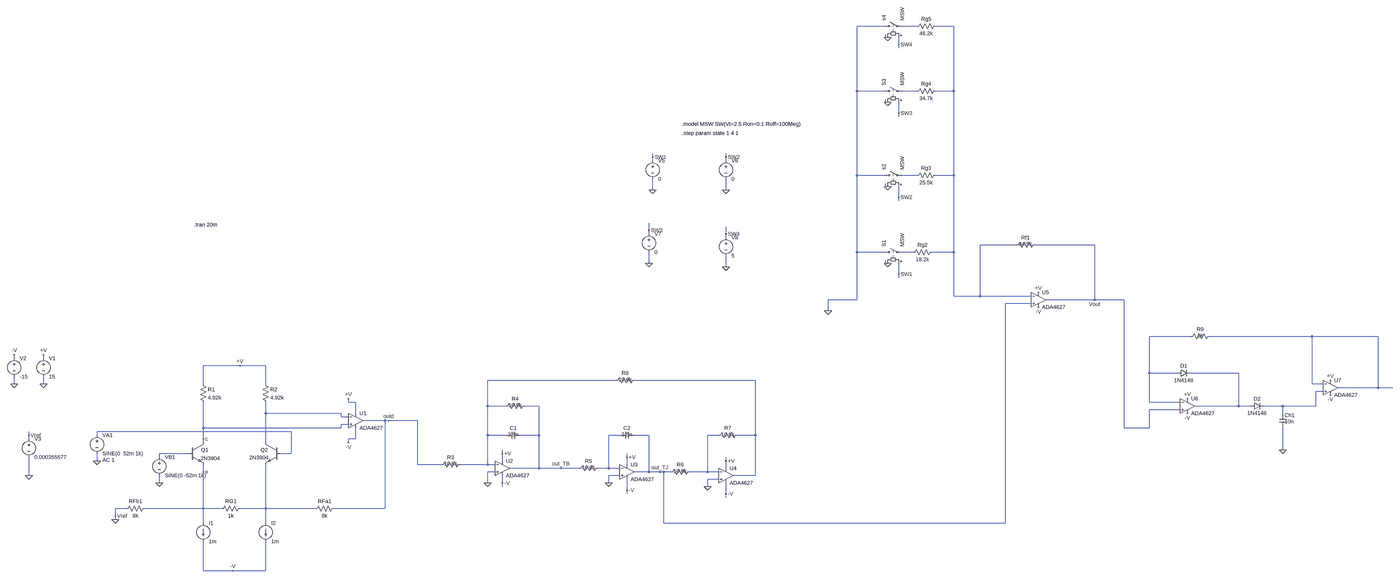
[diagram p0: schematic circuitcomplet.asc, whole sheet]
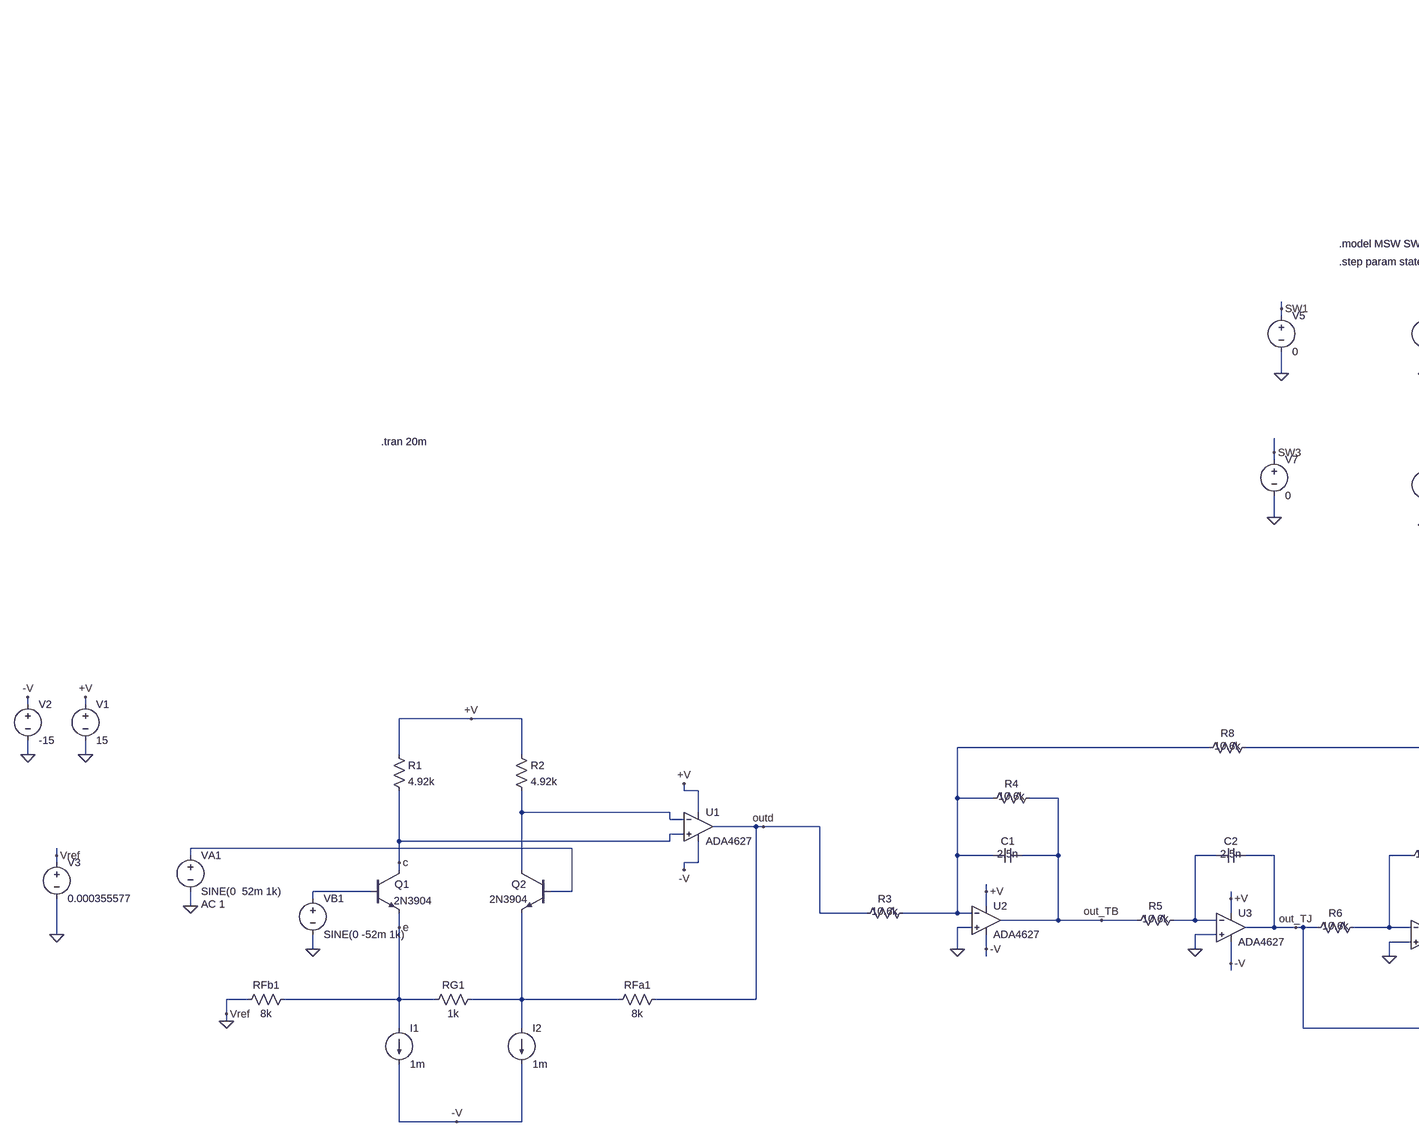
[diagram p1: schematic circuitcomplet.asc, part, row 1 of 1, column 1 of 2]
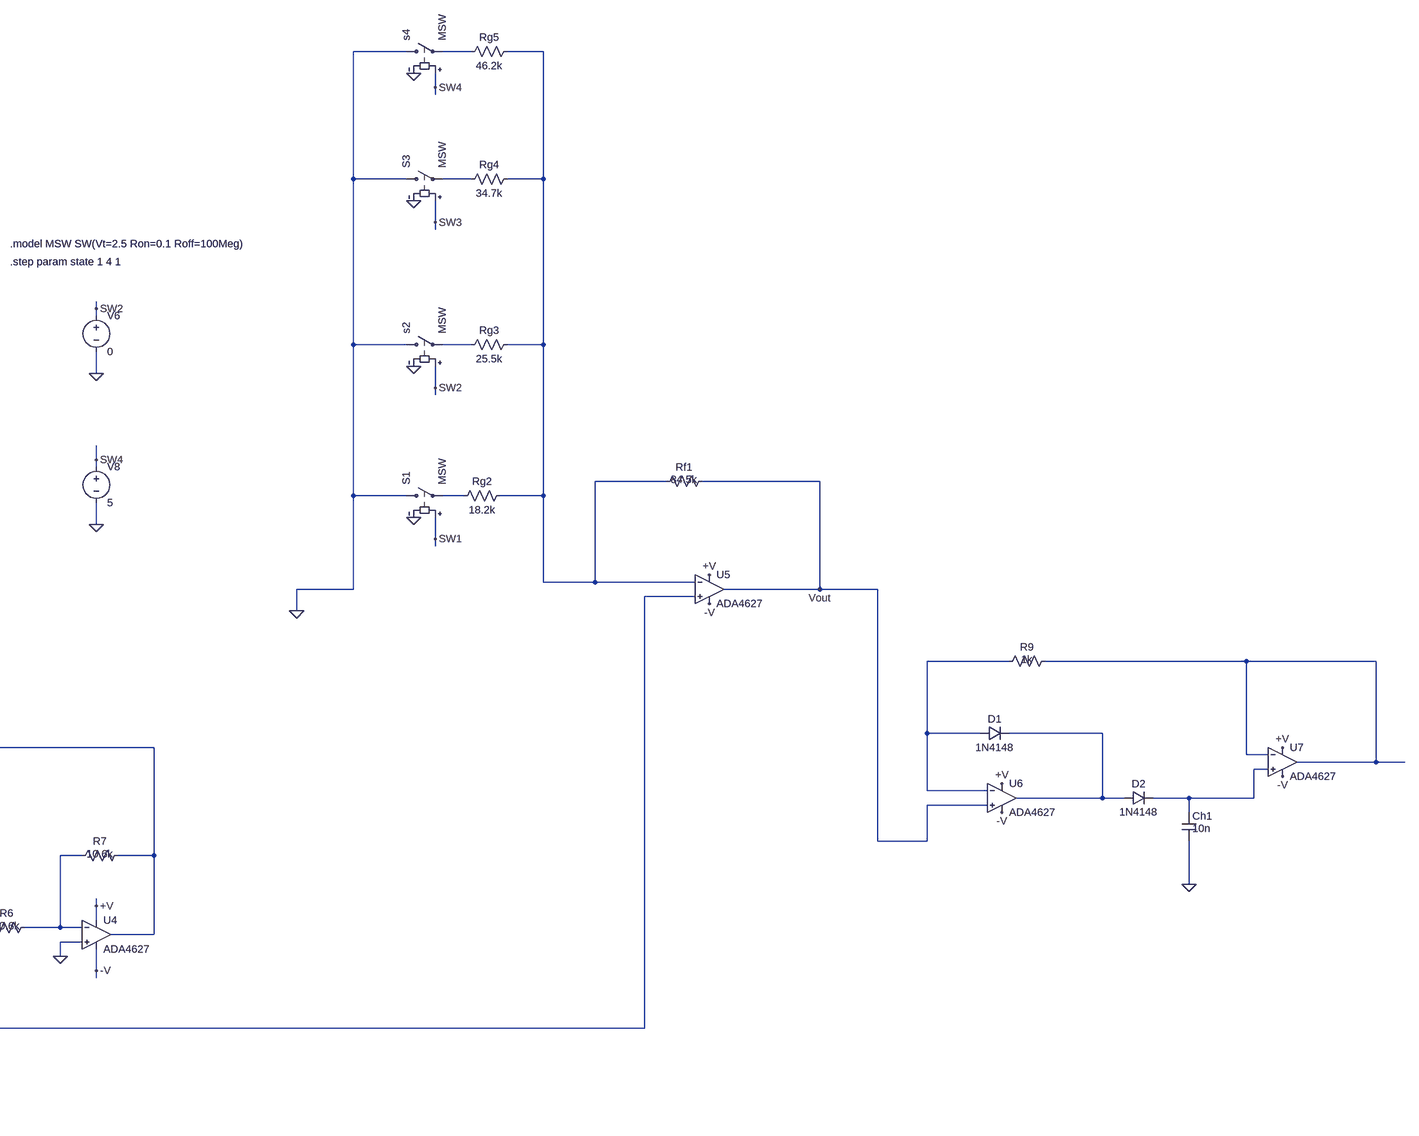
[diagram p2: schematic circuitcomplet.asc, part, row 1 of 1, column 2 of 2]
circuitcomplet.asc, the LTspice schematic file:
Version 4.1
SHEET 1 6404 680
WIRE 3520 -1840 3392 -1840
WIRE 3664 -1840 3600 -1840
WIRE 3824 -1840 3744 -1840
WIRE 3584 -1760 3584 -1792
WIRE 3584 -1744 3584 -1760
WIRE 3392 -1488 3392 -1840
WIRE 3520 -1488 3392 -1488
WIRE 3664 -1488 3600 -1488
WIRE 3824 -1488 3824 -1840
WIRE 3824 -1488 3744 -1488
WIRE 3584 -1392 3584 -1440
WIRE 3584 -1376 3584 -1392
WIRE 2272 -1200 2272 -1216
WIRE 2592 -1200 2592 -1216
WIRE 2272 -1184 2272 -1200
WIRE 2592 -1184 2592 -1200
WIRE 3392 -1120 3392 -1488
WIRE 3520 -1120 3392 -1120
WIRE 3664 -1120 3600 -1120
WIRE 3824 -1120 3824 -1488
WIRE 3824 -1120 3744 -1120
WIRE 2272 -1056 2272 -1104
WIRE 2592 -1056 2592 -1104
WIRE 3584 -1024 3584 -1072
WIRE 3584 -1008 3584 -1024
WIRE 2256 -880 2256 -912
WIRE 2256 -864 2256 -880
WIRE 2592 -864 2592 -896
WIRE 2592 -848 2592 -864
WIRE 4576 -816 4304 -816
WIRE 4944 -816 4656 -816
WIRE 3392 -784 3392 -1120
WIRE 3520 -784 3392 -784
WIRE 3648 -784 3600 -784
WIRE 3824 -784 3824 -1120
WIRE 3824 -784 3728 -784
WIRE 2256 -736 2256 -784
WIRE 2592 -720 2592 -768
WIRE 3584 -688 3584 -736
WIRE 3584 -672 3584 -688
WIRE 3824 -592 3824 -784
WIRE 4304 -592 4304 -816
WIRE 4304 -592 3824 -592
WIRE 4640 -592 4304 -592
WIRE 3392 -576 3392 -784
WIRE 3392 -576 3264 -576
WIRE 4944 -576 4944 -816
WIRE 4944 -576 4704 -576
WIRE 5136 -576 4944 -576
WIRE 4640 -560 4528 -560
WIRE 3264 -528 3264 -576
WIRE 5520 -416 5328 -416
WIRE 6048 -416 5600 -416
WIRE 6336 -416 6048 -416
WIRE -1024 -320 -1024 -336
WIRE -896 -320 -896 -336
WIRE 48 -288 -112 -288
WIRE 160 -288 48 -288
WIRE 5328 -256 5328 -416
WIRE 5456 -256 5328 -256
WIRE 5728 -256 5520 -256
WIRE 2112 -224 1552 -224
WIRE 2720 -224 2192 -224
WIRE -1024 -208 -1024 -240
WIRE -896 -208 -896 -240
WIRE -112 -208 -112 -288
WIRE 160 -208 160 -288
WIRE 6048 -208 6048 -416
WIRE 6096 -208 6048 -208
WIRE 6336 -192 6336 -416
WIRE 6336 -192 6160 -192
WIRE 6400 -192 6336 -192
WIRE 6096 -176 6064 -176
WIRE 656 -128 656 -144
WIRE 688 -128 656 -128
WIRE 5328 -128 5328 -256
WIRE 5472 -128 5328 -128
WIRE 1552 -112 1552 -224
WIRE 1632 -112 1552 -112
WIRE 1776 -112 1712 -112
WIRE 5728 -112 5728 -256
WIRE 5728 -112 5536 -112
WIRE 5776 -112 5728 -112
WIRE 5920 -112 5840 -112
WIRE 6064 -112 6064 -176
WIRE 6064 -112 5920 -112
WIRE 5472 -96 5328 -96
WIRE 160 -80 160 -128
WIRE 624 -80 160 -80
WIRE 688 -80 688 -128
WIRE 5920 -80 5920 -112
WIRE 624 -64 624 -80
WIRE 656 -64 624 -64
WIRE 816 -48 720 -48
WIRE 832 -48 816 -48
WIRE 1008 -48 832 -48
WIRE 656 -32 624 -32
WIRE -112 -16 -112 -128
WIRE 624 -16 624 -32
WIRE 624 -16 -112 -16
WIRE 5136 -16 5136 -576
WIRE 5328 -16 5328 -96
WIRE 5328 -16 5136 -16
WIRE 272 0 -576 0
WIRE -960 16 -960 0
WIRE -576 16 -576 0
WIRE 1552 16 1552 -112
WIRE 1632 16 1552 16
WIRE 1776 16 1776 -112
WIRE 1776 16 1696 16
WIRE 2128 16 2080 16
WIRE 2256 16 2192 16
WIRE 2560 16 2512 16
WIRE 2720 16 2720 -224
WIRE 2720 16 2640 16
WIRE -960 32 -960 16
WIRE -112 32 -112 -16
WIRE 688 32 688 -16
WIRE 688 32 656 32
WIRE -112 48 -112 32
WIRE 160 48 160 -80
WIRE 656 48 656 32
WIRE 5920 80 5920 -16
WIRE -176 96 -304 96
WIRE 272 96 272 0
WIRE 272 96 224 96
WIRE 1616 96 1616 80
WIRE -304 112 -304 96
WIRE 2160 112 2160 96
WIRE -576 128 -576 96
WIRE 1616 128 1616 96
WIRE 2592 128 2592 112
WIRE 1008 144 1008 -48
WIRE 1344 144 1008 144
WIRE 1552 144 1552 16
WIRE 1552 144 1424 144
WIRE 1584 144 1552 144
WIRE 2160 144 2160 112
WIRE 1776 160 1776 16
WIRE 1776 160 1648 160
WIRE 1872 160 1776 160
WIRE 1952 160 1872 160
WIRE 2080 160 2080 16
WIRE 2080 160 2032 160
WIRE 2128 160 2080 160
WIRE 2592 160 2592 128
WIRE -112 176 -112 144
WIRE 1584 176 1552 176
WIRE 2256 176 2256 16
WIRE 2256 176 2192 176
WIRE 2304 176 2256 176
WIRE 2320 176 2304 176
WIRE 2352 176 2320 176
WIRE 2512 176 2512 16
WIRE 2512 176 2432 176
WIRE 2560 176 2512 176
WIRE -960 192 -960 112
WIRE 2128 192 2080 192
WIRE 2720 192 2720 16
WIRE 2720 192 2624 192
WIRE 2560 208 2512 208
WIRE -304 224 -304 192
WIRE 1552 224 1552 176
WIRE 1616 224 1616 192
WIRE 2080 224 2080 192
WIRE 1616 240 1616 224
WIRE 2512 240 2512 208
WIRE 2160 256 2160 208
WIRE 2160 272 2160 256
WIRE 2592 272 2592 224
WIRE 2592 288 2592 272
WIRE -448 336 -496 336
WIRE -112 336 -112 176
WIRE -112 336 -368 336
WIRE -32 336 -112 336
WIRE 160 336 160 144
WIRE 160 336 48 336
WIRE 512 336 160 336
WIRE 816 336 816 -48
WIRE 816 336 592 336
WIRE -496 368 -496 336
WIRE -496 384 -496 368
WIRE -112 400 -112 336
WIRE 160 400 160 336
WIRE 2320 400 2320 176
WIRE 4528 400 4528 -560
WIRE 4528 400 2320 400
WIRE -112 608 -112 480
WIRE 16 608 -112 608
WIRE 160 608 160 480
WIRE 160 608 16 608
FLAG -896 -208 0
FLAG -896 -336 +V
FLAG -1024 -208 0
FLAG -1024 -336 -V
FLAG 656 -144 +V
FLAG 656 48 -V
FLAG 832 -48 outd
FLAG 48 -288 +V
FLAG -496 384 0
FLAG 16 608 -V
FLAG -112 32 c
FLAG -112 176 e
FLAG -576 128 0
FLAG -304 224 0
FLAG -496 368 Vref
FLAG -960 16 Vref
FLAG -960 192 0
FLAG 1552 224 0
FLAG 2080 224 0
FLAG 2512 240 0
FLAG 1616 96 +V
FLAG 2160 112 +V
FLAG 2592 128 +V
FLAG 1616 224 -V
FLAG 2160 256 -V
FLAG 2592 272 -V
FLAG 2304 176 out_TJ
FLAG 1872 160 out_TB
FLAG 2272 -1056 0
FLAG 2592 -1056 0
FLAG 2256 -736 0
FLAG 2592 -720 0
FLAG 2272 -1200 SW1
FLAG 2592 -1200 SW2
FLAG 2256 -880 SW3
FLAG 2592 -864 SW4
FLAG 3536 -736 0
FLAG 3536 -1072 0
FLAG 3536 -1440 0
FLAG 3536 -1792 0
FLAG 3584 -1760 SW4
FLAG 3584 -1392 SW3
FLAG 3584 -1024 SW2
FLAG 3584 -688 SW1
FLAG 4944 -576 Vout
FLAG 4672 -544 -V
FLAG 4672 -608 +V
FLAG 5920 80 0
FLAG 5504 -144 +V
FLAG 5504 -80 -V
FLAG 6128 -224 +V
FLAG 6128 -160 -V
FLAG 3264 -528 0
SYMBOL voltage -896 -336 R0
WINDOW 123 0 0 Left 2
WINDOW 39 0 0 Left 2
SYMATTR InstName V1
SYMATTR Value 15
SYMBOL voltage -1024 -336 R0
WINDOW 123 0 0 Left 2
WINDOW 39 0 0 Left 2
SYMATTR InstName V2
SYMATTR Value -15
SYMBOL npn -176 48 R0
WINDOW 0 54 32 Left 2
WINDOW 3 52 69 Left 2
SYMATTR InstName Q1
SYMATTR Value 2N3904
SYMBOL npn 224 48 M0
WINDOW 0 54 32 Left 2
WINDOW 3 51 65 Left 2
SYMATTR InstName Q2
SYMATTR Value 2N3904
SYMBOL res -128 -224 R0
SYMATTR InstName R1
SYMATTR Value 4.92k
SYMBOL res 144 -224 R0
SYMATTR InstName R2
SYMATTR Value 4.92k
SYMBOL res 608 320 R90
WINDOW 0 0 56 VBottom 2
WINDOW 3 32 56 VTop 2
SYMATTR InstName RFa1
SYMATTR Value 8k
SYMBOL res 64 320 R90
WINDOW 0 0 56 VBottom 2
WINDOW 3 32 56 VTop 2
SYMATTR InstName RG1
SYMATTR Value 1k
SYMBOL res -352 320 R90
WINDOW 0 0 56 VBottom 2
WINDOW 3 32 56 VTop 2
SYMATTR InstName RFb1
SYMATTR Value 8k
SYMBOL current -112 400 R0
WINDOW 123 0 0 Left 0
WINDOW 39 0 0 Left 0
SYMATTR InstName I1
SYMATTR Value 1m
SYMBOL current 160 400 R0
WINDOW 123 0 0 Left 0
WINDOW 39 0 0 Left 0
SYMATTR InstName I2
SYMATTR Value 1m
SYMBOL OpAmps\\ADA4627 688 -112 R0
SYMATTR InstName U1
SYMBOL voltage -304 96 R0
WINDOW 123 0 0 Left 0
WINDOW 39 0 0 Left 0
SYMATTR InstName VB1
SYMATTR Value SINE(0 -52m 1k)
SYMBOL voltage -576 0 R0
WINDOW 123 24 124 Left 2
WINDOW 39 0 0 Left 0
SYMATTR Value2 AC 1
SYMATTR InstName VA1
SYMATTR Value SINE(0  52m 1k)
SYMBOL voltage -960 16 R0
SYMATTR InstName V3
SYMATTR Value 0.000355577
SYMBOL res 1440 128 R90
WINDOW 0 0 56 VBottom 2
WINDOW 3 28 56 VBottom 2
SYMATTR InstName R3
SYMATTR Value 10.6k
SYMBOL res 1728 -128 R90
WINDOW 0 0 56 VBottom 2
WINDOW 3 28 56 VBottom 2
SYMATTR InstName R4
SYMATTR Value 10.6k
SYMBOL res 2048 144 R90
WINDOW 0 0 56 VBottom 2
WINDOW 3 28 56 VBottom 2
SYMATTR InstName R5
SYMATTR Value 10.6k
SYMBOL res 2448 160 R90
WINDOW 0 0 56 VBottom 2
WINDOW 3 28 56 VBottom 2
SYMATTR InstName R6
SYMATTR Value 10.6k
SYMBOL res 2656 0 R90
WINDOW 0 0 56 VBottom 2
WINDOW 3 28 56 VBottom 2
SYMATTR InstName R7
SYMATTR Value 10.6k
SYMBOL cap 1696 0 R90
WINDOW 0 0 32 VBottom 2
WINDOW 3 28 32 VBottom 2
SYMATTR InstName C1
SYMATTR Value 2.5n
SYMBOL cap 2192 0 R90
WINDOW 0 0 32 VBottom 2
WINDOW 3 28 32 VBottom 2
SYMATTR InstName C2
SYMATTR Value 2.5n
SYMBOL res 2208 -240 R90
WINDOW 0 0 56 VBottom 2
WINDOW 3 28 56 VBottom 2
SYMATTR InstName R8
SYMATTR Value 10.6k
SYMBOL OpAmps\\ADA4627 1616 96 R0
SYMATTR InstName U2
SYMBOL OpAmps\\ADA4627 2160 112 R0
SYMATTR InstName U3
SYMBOL OpAmps\\ADA4627 2592 128 R0
SYMATTR InstName U4
SYMBOL voltage 2272 -1200 R0
WINDOW 123 0 0 Left 0
WINDOW 39 0 0 Left 0
SYMATTR InstName V5
SYMATTR Value 0
SYMBOL voltage 2592 -1200 R0
WINDOW 123 0 0 Left 0
WINDOW 39 0 0 Left 0
SYMATTR InstName V6
SYMATTR Value 0
SYMBOL voltage 2256 -880 R0
WINDOW 123 0 0 Left 0
WINDOW 39 0 0 Left 0
SYMATTR InstName V7
SYMATTR Value 0
SYMBOL voltage 2592 -864 R0
WINDOW 123 0 0 Left 0
WINDOW 39 0 0 Left 0
SYMATTR InstName V8
SYMATTR Value 5
SYMBOL sw 3504 -784 R270
SYMATTR InstName S1
SYMATTR Value MSW
SYMBOL sw 3504 -1120 R270
SYMATTR InstName s2
SYMATTR Value MSW
SYMBOL sw 3504 -1488 R270
SYMATTR InstName S3
SYMATTR Value MSW
SYMBOL sw 3504 -1840 R270
SYMATTR InstName s4
SYMATTR Value MSW
SYMBOL res 3744 -800 R90
WINDOW 0 0 56 VBottom 2
WINDOW 3 32 56 VTop 2
SYMATTR InstName Rg2
SYMATTR Value 18.2k
SYMBOL res 3760 -1136 R90
WINDOW 0 0 56 VBottom 2
WINDOW 3 32 56 VTop 2
SYMATTR InstName Rg3
SYMATTR Value 25.5k
SYMBOL res 3760 -1504 R90
WINDOW 0 0 56 VBottom 2
WINDOW 3 32 56 VTop 2
SYMATTR InstName Rg4
SYMATTR Value 34.7k
SYMBOL res 3760 -1856 R90
WINDOW 0 0 56 VBottom 2
WINDOW 3 32 56 VTop 2
SYMATTR InstName Rg5
SYMATTR Value 46.2k
SYMBOL OpAmps\\ADA4627 4672 -640 R0
SYMATTR InstName U5
SYMBOL res 4672 -832 R90
WINDOW 0 0 56 VBottom 2
WINDOW 3 28 56 VBottom 2
SYMATTR InstName Rf1
SYMATTR Value 84.5k
SYMBOL OpAmps\\ADA4627 5504 -176 R0
SYMATTR InstName U6
SYMBOL diode 5456 -240 R270
WINDOW 0 32 32 VTop 2
WINDOW 3 0 32 VBottom 2
SYMATTR InstName D1
SYMATTR Value 1N4148
SYMBOL res 5616 -432 R90
WINDOW 0 0 56 VBottom 2
WINDOW 3 28 56 VBottom 2
SYMATTR InstName R9
SYMATTR Value 1k
SYMBOL diode 5776 -96 R270
WINDOW 0 32 32 VTop 2
WINDOW 3 0 32 VBottom 2
SYMATTR InstName D2
SYMATTR Value 1N4148
SYMBOL cap 5904 -80 R0
WINDOW 3 24 36 Left 2
SYMATTR Value 10n
SYMATTR InstName Ch1
SYMBOL OpAmps\\ADA4627 6128 -256 R0
SYMATTR InstName U7
TEXT 2400 -1304 Left 2 !.step param state 1 4 1
TEXT 2400 -1344 Left 2 !.model MSW SW(Vt=2.5 Ron=0.1 Roff=100Meg)
TEXT -152 -904 Left 2 !.tran 20m

The netlist it stands for:
* circuitcomplet.asc
V1 +V 0 15
V2 -V 0 -15
Q1 c N016 e 0 2N3904
Q2 N012 N013 N017 0 2N3904
R1 +V c 4.92k
R2 +V N012 4.92k
RFa1 outd N017 8k
RG1 N017 e 1k
RFb1 e 0 8k
I1 e -V 1m
I2 N017 -V 1m
X§U1 c N012 +V -V outd ADA4627  ; pins In+ In- V+ V- OUT
VB1 N016 0 SINE(0 -52m 1k)
VA1 N013 0 SINE(0  52m 1k) AC 1
V3 0 0 0.000355577
R3 N009 outd 10.6k
R4 out_TB N009 10.6k
R5 N014 out_TB 10.6k
R6 N015 out_TJ 10.6k
R7 N010 N015 10.6k
C1 out_TB N009 2.5n
C2 out_TJ N014 2.5n
R8 N010 N009 10.6k
X§U2 0 N009 +V -V out_TB ADA4627  ; pins In+ In- V+ V- OUT
X§U3 0 N014 +V -V out_TJ ADA4627  ; pins In+ In- V+ V- OUT
X§U4 0 N015 +V -V N010 ADA4627  ; pins In+ In- V+ V- OUT
V5 SW1 0 0
V6 SW2 0 0
V7 SW3 0 0
V8 SW4 0 5
S1 0 N005 SW1 0 MSW
s2 0 N004 SW2 0 MSW
S3 0 N003 SW3 0 MSW
s4 0 N001 SW4 0 MSW
Rg2 N002 N005 18.2k
Rg3 N002 N004 25.5k
Rg4 N002 N003 34.7k
Rg5 N002 N001 46.2k
X§U5 out_TJ N002 +V -V Vout ADA4627  ; pins In+ In- V+ V- OUT
Rf1 Vout N002 84.5k
X§U6 Vout N006 +V -V N008 ADA4627  ; pins In+ In- V+ V- OUT
D1 N006 N008 1N4148
R9 N007 N006 1k
D2 N008 N011 1N4148
Ch1 N011 0 10n
X§U7 N011 N007 +V -V N007 ADA4627  ; pins In+ In- V+ V- OUT
.model D D
.lib standard.dio
.model NPN NPN
.model PNP PNP
.lib standard.bjt
.step param state 1 4 1
.model MSW SW(Vt=2.5 Ron=0.1 Roff=100Meg)
.tran 20m
.backanno
.end